# Altium schematic sheet 000-PDN.SchDoc
size A4
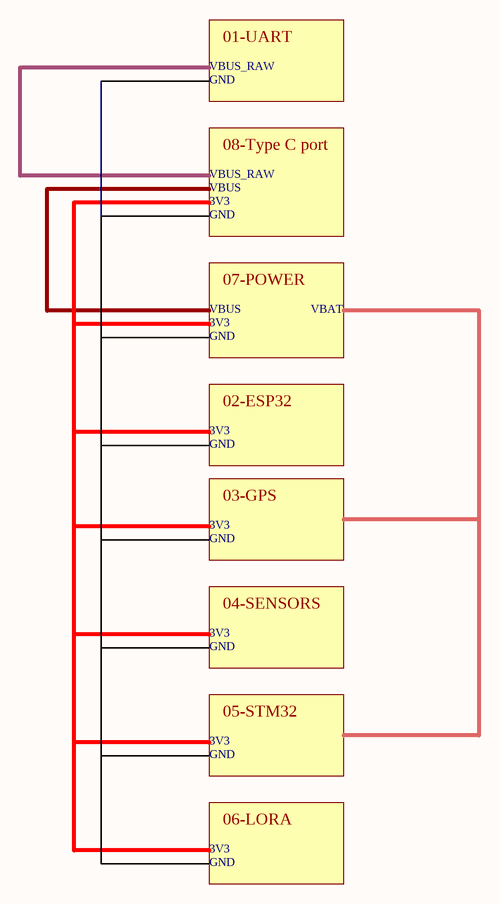
[diagram p0: 000-PDN.SchDoc]

## Notes on the sheet
- VBUS_RAW
- 01-UART
- GND
- VBUS
- 3V3
- 08-Type C port
- 07-POWER
- VBAT
- 02-ESP32
- 03-GPS
- 04-SENSORS
- 05-STM32
- 06-LORA